# Altium project test_git.PrjPcb
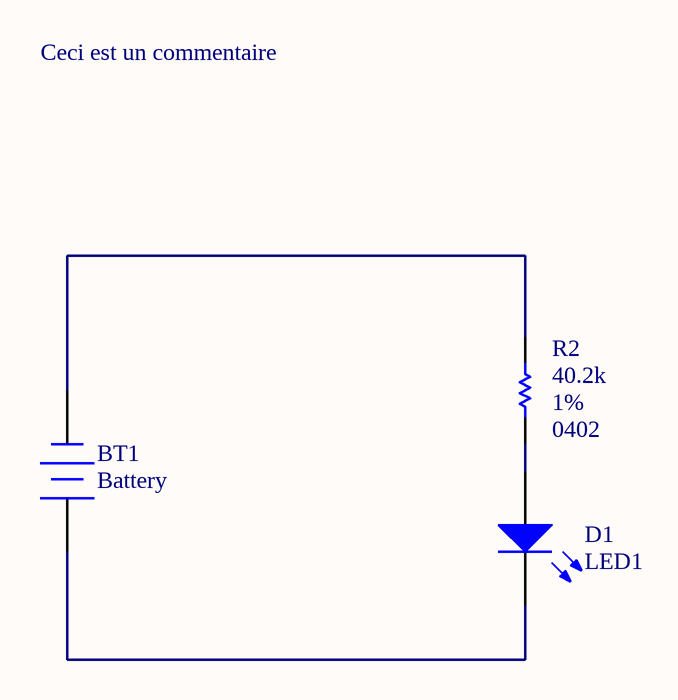
[diagram p0: test_sch.SchDoc]
1 sheet, 3 parts. Net scope: global (net labels, ports and power ports of the same name join across sheets).
Board file: test_pcb.PcbDoc

## Sheet test_sch.SchDoc
size A4

### Parts
BT1  Battery  [BAT-2]
D1  LED1  [LED-1]
R2  value 40.2k  Case-EIA: 0402  Tolerance: 1%  [RESC0402(1005)_L]  (hidden comment: RES0402)

### Nets
NetBT1_1: BT1.1(+) D1.2(K)
NetBT1_2: BT1.2(-) R2.2
NetD1_1: D1.1(A) R2.1

### Notes on the sheet
- Ceci est un commentaire

### Library data of the parts
BT1 = Battery: Multicell Battery; Published: 24-Mar-1999; LatestRevisionDate: 17-Jul-2002; LatestRevisionNote: Re-released for DXP Platform.; PackageReference: BAT-2; Publisher: Altium Limited; PackageDescription: Battery; 2 Leads
D1 = LED1: Typical RED GaAs LED; Published: 8-Jun-2000; LatestRevisionDate: 08-Jul-2005; LatestRevisionNote: Mech Layer 1 removed.; PackageReference: LED-1; Publisher: Altium Limited; PackageDescription: LED; 2 Leads
R2 = CMP-1591-00004-1: 0402 (1005 Metric) Chip Resistor; Case-Metric: 1005; PackageReference: RESC0402(1005)